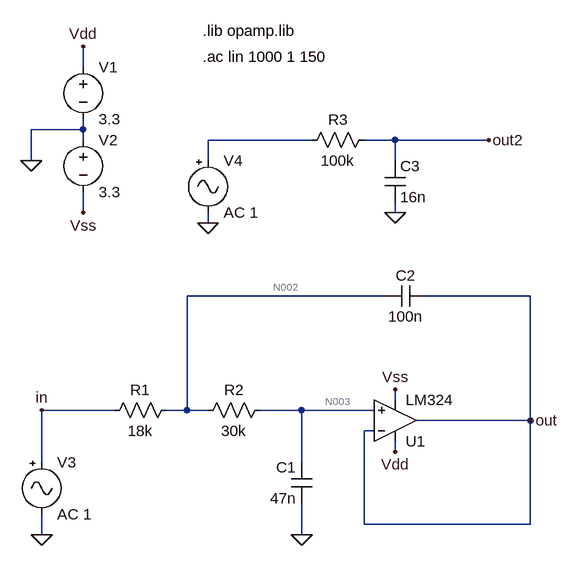
[diagram p0: schematic passa_baixas_vcvs_2_ordem.asc]
passa_baixas_vcvs_2_ordem.asc, the LTspice schematic file:
Version 4
SHEET 1 1384 680
WIRE -304 -368 -304 -400
WIRE -304 -272 -304 -288
WIRE -304 -272 -384 -272
WIRE -304 -256 -304 -272
WIRE 48 -256 -112 -256
WIRE 176 -256 128 -256
WIRE 320 -256 176 -256
WIRE -384 -224 -384 -272
WIRE -112 -224 -112 -256
WIRE 176 -224 176 -256
WIRE -304 -144 -304 -176
WIRE 176 -144 176 -160
WIRE -112 -128 -112 -144
WIRE 160 -16 -144 -16
WIRE 384 -16 224 -16
WIRE 176 144 176 128
WIRE -256 160 -368 160
WIRE -144 160 -144 -16
WIRE -144 160 -176 160
WIRE -112 160 -144 160
WIRE 32 160 -32 160
WIRE 144 160 32 160
WIRE 384 176 384 -16
WIRE 384 176 208 176
WIRE 144 192 128 192
WIRE 176 224 176 208
WIRE -368 240 -368 160
WIRE 32 240 32 160
WIRE 128 336 128 192
WIRE 384 336 384 176
WIRE 384 336 128 336
WIRE -368 352 -368 320
WIRE 32 352 32 304
FLAG 32 352 0
FLAG -384 -224 0
FLAG -304 -400 Vdd
FLAG 176 224 Vdd
FLAG 176 128 Vss
FLAG -304 -144 Vss
FLAG -368 352 0
FLAG 384 176 out
FLAG -368 160 in
FLAG 176 -144 0
FLAG 320 -256 out2
FLAG -112 -128 0
SYMBOL voltage -304 -384 R0
SYMATTR InstName V1
SYMATTR Value 3.3
SYMBOL voltage -304 -272 R0
SYMATTR InstName V2
SYMATTR Value 3.3
SYMBOL Misc\\signal -368 224 R0
WINDOW 123 0 0 Left 2
WINDOW 39 0 0 Left 2
SYMATTR InstName V3
SYMATTR Value AC 1
SYMBOL res -16 144 R90
WINDOW 0 0 56 VBottom 2
WINDOW 3 32 56 VTop 2
SYMATTR InstName R2
SYMATTR Value 30k
SYMBOL res -160 144 R90
WINDOW 0 0 56 VBottom 2
WINDOW 3 32 56 VTop 2
SYMATTR InstName R1
SYMATTR Value 18k
SYMBOL cap 48 304 R180
WINDOW 0 24 56 Left 2
WINDOW 3 24 8 Left 2
SYMATTR InstName C1
SYMATTR Value 47n
SYMBOL cap 160 0 R270
WINDOW 0 32 32 VTop 2
WINDOW 3 0 32 VBottom 2
SYMATTR InstName C2
SYMATTR Value 100n
SYMBOL res 144 -272 R90
WINDOW 0 0 56 VBottom 2
WINDOW 3 32 56 VTop 2
SYMATTR InstName R3
SYMATTR Value 100k
SYMBOL cap 160 -224 R0
SYMATTR InstName C3
SYMATTR Value 16n
SYMBOL Misc\\signal -112 -240 R0
SYMATTR InstName V4
SYMATTR Value AC 1
SYMBOL Opamps\\opamp2 176 240 M180
SYMATTR InstName U1
SYMATTR Value LM324
TEXT -120 -384 Left 2 !.ac lin 1000 1 150
TEXT -120 -424 Left 2 !.lib opamp.lib

The netlist it stands for:
* passa_baixas_vcvs_2_ordem.asc
V1 Vdd 0 3.3
V2 0 Vss 3.3
V3 in 0 AC 1
R2 N003 N002 30k
R1 N002 in 18k
C1 0 N003 47n
C2 N002 out 100n
R3 out2 N001 100k
C3 out2 0 16n
V4 N001 0 AC 1
XU1 N003 out Vdd Vss out LM324  ; pins In+ In- V+ V- OUT
.ac lin 1000 1 150
.lib opamp.lib
.backanno
.end

* Results of the author's LTspice run, read from the files saved beside the schematic
* Operating Point, zero values left out:
*   V(vdd) = 3.3 V
*   V(vss) = -3.3 V
*   V(n003) = 2.148 mV
*   V(n002) = 805.4 µV
*   V(out) = 1.954 mV
*   I(R1) = 44.74 nA
*   I(R2) = 44.74 nA
*   I(V3) = 44.74 nA
*   I(V2) = -742 µA
*   I(V1) = -742.1 µA
*   Ix(u1:1) = -44.74 nA
*   Ix(u1:2) = -44.96 nA
*   Ix(u1:3) = 742.1 µA
*   Ix(u1:4) = -742 µA
*   Ix(u1:5) = 44.96 nA
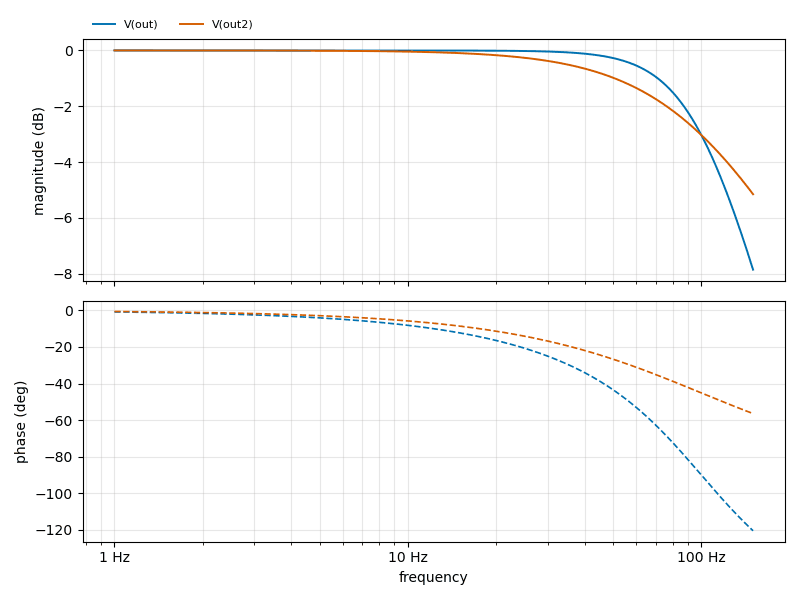
[diagram p1: AC Analysis of passa_baixas_vcvs_2_ordem.asc, plotted from the saved traces]
* AC Analysis, 1 run:
*   V(out): -0.00 dB at 1 Hz, -7.85 dB at 150 Hz, peak -0.00 dB at 1 Hz, 3 dB below the peak at 99.74 Hz
*   V(out2): -0.00 dB at 1 Hz, -5.15 dB at 150 Hz, peak -0.00 dB at 1 Hz, 3 dB below the peak at 99.48 Hz